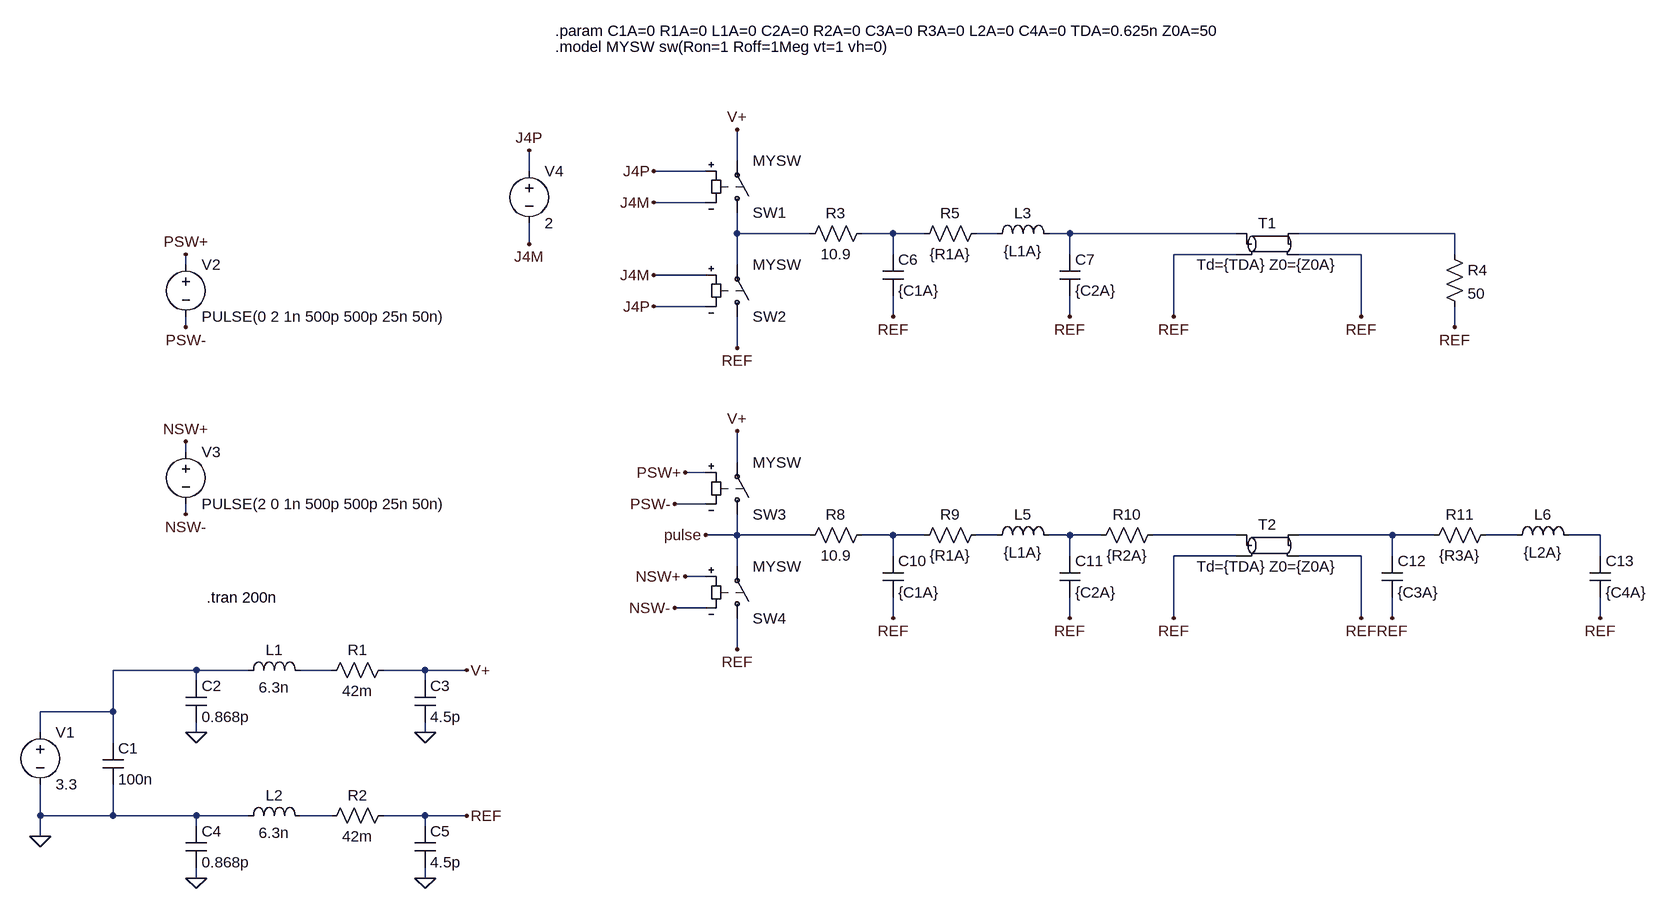
[diagram p0: schematic circuit_model.asc]
circuit_model.asc, the LTspice schematic file:
Version 4
SHEET 1 3648 1368
WIRE 1040 -752 1040 -800
WIRE 720 -736 720 -768
WIRE 992 -736 912 -736
WIRE 992 -688 912 -688
WIRE 1040 -640 1040 -672
WIRE 1152 -640 1040 -640
WIRE 1280 -640 1232 -640
WIRE 1328 -640 1280 -640
WIRE 1440 -640 1408 -640
WIRE 1552 -640 1520 -640
WIRE 1808 -640 1552 -640
WIRE 2144 -640 1904 -640
WIRE 720 -624 720 -656
WIRE 1280 -608 1280 -640
WIRE 1552 -608 1552 -640
WIRE 1808 -608 1712 -608
WIRE 2000 -608 1904 -608
WIRE 2144 -608 2144 -640
WIRE 192 -592 192 -608
WIRE 1040 -592 1040 -640
WIRE 992 -576 912 -576
WIRE 992 -528 912 -528
WIRE 1280 -512 1280 -544
WIRE 1552 -512 1552 -544
WIRE 1712 -512 1712 -608
WIRE 2000 -512 2000 -608
WIRE 192 -496 192 -512
WIRE 2144 -496 2144 -528
WIRE 1040 -464 1040 -512
WIRE 192 -304 192 -320
WIRE 1040 -288 1040 -336
WIRE 992 -272 960 -272
WIRE 992 -224 944 -224
WIRE 192 -208 192 -224
WIRE 1040 -176 1040 -208
WIRE 1040 -176 992 -176
WIRE 1152 -176 1040 -176
WIRE 1280 -176 1232 -176
WIRE 1328 -176 1280 -176
WIRE 1440 -176 1408 -176
WIRE 1552 -176 1520 -176
WIRE 1600 -176 1552 -176
WIRE 1808 -176 1680 -176
WIRE 2048 -176 1904 -176
WIRE 2112 -176 2048 -176
WIRE 2240 -176 2192 -176
WIRE 2368 -176 2320 -176
WIRE 1280 -144 1280 -176
WIRE 1552 -144 1552 -176
WIRE 1808 -144 1712 -144
WIRE 2000 -144 1904 -144
WIRE 2048 -144 2048 -176
WIRE 2368 -144 2368 -176
WIRE 1040 -128 1040 -176
WIRE 992 -112 960 -112
WIRE 992 -64 944 -64
WIRE 1280 -48 1280 -80
WIRE 1552 -48 1552 -80
WIRE 1712 -48 1712 -144
WIRE 2000 -48 2000 -144
WIRE 2048 -48 2048 -80
WIRE 2368 -48 2368 -80
WIRE 1040 0 1040 -48
WIRE 208 32 80 32
WIRE 288 32 208 32
WIRE 416 32 368 32
WIRE 560 32 496 32
WIRE 624 32 560 32
WIRE 208 48 208 32
WIRE 560 48 560 32
WIRE 80 96 80 32
WIRE 80 96 -32 96
WIRE -32 128 -32 96
WIRE 208 128 208 112
WIRE 560 128 560 112
WIRE 80 144 80 96
WIRE -32 256 -32 208
WIRE 80 256 80 208
WIRE 80 256 -32 256
WIRE 208 256 80 256
WIRE 288 256 208 256
WIRE 416 256 368 256
WIRE 560 256 496 256
WIRE 624 256 560 256
WIRE 208 272 208 256
WIRE 560 272 560 256
WIRE -32 288 -32 256
WIRE 208 352 208 336
WIRE 560 352 560 336
FLAG -32 288 0
FLAG 560 128 0
FLAG 208 128 0
FLAG 560 352 0
FLAG 208 352 0
FLAG 624 32 V+
FLAG 624 256 REF
FLAG 1040 -800 V+
FLAG 1040 -464 REF
FLAG 1280 -512 REF
FLAG 1552 -512 REF
FLAG 2000 -512 REF
FLAG 1712 -512 REF
FLAG 192 -496 PSW-
FLAG 192 -608 PSW+
FLAG 192 -208 NSW-
FLAG 192 -320 NSW+
FLAG 2144 -496 REF
FLAG 960 -272 PSW+
FLAG 944 -224 PSW-
FLAG 960 -112 NSW+
FLAG 944 -64 NSW-
FLAG 1040 -336 V+
FLAG 1040 0 REF
FLAG 1280 -48 REF
FLAG 1552 -48 REF
FLAG 2048 -48 REF
FLAG 2368 -48 REF
FLAG 2000 -48 REF
FLAG 1712 -48 REF
FLAG 992 -176 pulse
FLAG 912 -688 J4M
FLAG 912 -736 J4P
FLAG 720 -624 J4M
FLAG 720 -768 J4P
FLAG 912 -528 J4P
FLAG 912 -576 J4M
SYMBOL voltage -32 112 R0
WINDOW 123 0 0 Left 0
WINDOW 39 0 0 Left 0
SYMATTR InstName V1
SYMATTR Value 3.3
SYMBOL cap 64 144 R0
SYMATTR InstName C1
SYMATTR Value 100n
SYMBOL cap 192 48 R0
SYMATTR InstName C2
SYMATTR Value 0.868p
SYMBOL ind 272 48 R270
WINDOW 0 32 56 VTop 2
WINDOW 3 5 56 VBottom 2
SYMATTR InstName L1
SYMATTR Value 6.3n
SYMBOL res 512 16 R90
WINDOW 0 0 56 VBottom 2
WINDOW 3 32 56 VTop 2
SYMATTR InstName R1
SYMATTR Value 42m
SYMBOL cap 544 48 R0
SYMATTR InstName C3
SYMATTR Value 4.5p
SYMBOL cap 192 272 R0
SYMATTR InstName C4
SYMATTR Value 0.868p
SYMBOL ind 272 272 R270
WINDOW 0 32 56 VTop 2
WINDOW 3 5 56 VBottom 2
SYMATTR InstName L2
SYMATTR Value 6.3n
SYMBOL res 512 240 R90
WINDOW 0 0 56 VBottom 2
WINDOW 3 32 56 VTop 2
SYMATTR InstName R2
SYMATTR Value 42m
SYMBOL cap 544 272 R0
SYMATTR InstName C5
SYMATTR Value 4.5p
SYMBOL sw 1040 -656 M180
SYMATTR InstName SW1
SYMATTR Value MYSW
SYMBOL res 1248 -656 R90
WINDOW 0 0 56 VBottom 2
WINDOW 3 32 56 VTop 2
SYMATTR InstName R3
SYMATTR Value 10.9
SYMBOL sw 1040 -496 M180
SYMATTR InstName SW2
SYMATTR Value MYSW
SYMBOL cap 1264 -608 R0
SYMATTR InstName C6
SYMATTR Value {C1A}
SYMBOL res 1424 -656 R90
WINDOW 0 0 56 VBottom 2
WINDOW 3 32 56 VTop 2
SYMATTR InstName R5
SYMATTR Value {R1A}
SYMBOL ind 1424 -624 R270
WINDOW 0 32 56 VTop 2
WINDOW 3 5 56 VBottom 2
SYMATTR InstName L3
SYMATTR Value {L1A}
SYMBOL tline 1856 -624 R0
SYMATTR InstName T1
SYMATTR Value Td={TDA} Z0={Z0A}
SYMBOL cap 1536 -608 R0
SYMATTR InstName C7
SYMATTR Value {C2A}
SYMBOL voltage 192 -608 R0
WINDOW 123 0 0 Left 0
WINDOW 39 0 0 Left 0
SYMATTR InstName V2
SYMATTR Value PULSE(0 2 1n 500p 500p 25n 50n)
SYMBOL voltage 192 -320 R0
WINDOW 123 0 0 Left 0
WINDOW 39 0 0 Left 0
SYMATTR InstName V3
SYMATTR Value PULSE(2 0 1n 500p 500p 25n 50n)
SYMBOL res 2128 -624 R0
SYMATTR InstName R4
SYMATTR Value 50
SYMBOL sw 1040 -192 M180
SYMATTR InstName SW3
SYMATTR Value MYSW
SYMBOL res 1248 -192 R90
WINDOW 0 0 56 VBottom 2
WINDOW 3 32 56 VTop 2
SYMATTR InstName R8
SYMATTR Value 10.9
SYMBOL sw 1040 -32 M180
SYMATTR InstName SW4
SYMATTR Value MYSW
SYMBOL cap 1264 -144 R0
SYMATTR InstName C10
SYMATTR Value {C1A}
SYMBOL res 1424 -192 R90
WINDOW 0 0 56 VBottom 2
WINDOW 3 32 56 VTop 2
SYMATTR InstName R9
SYMATTR Value {R1A}
SYMBOL ind 1424 -160 R270
WINDOW 0 32 56 VTop 2
WINDOW 3 5 56 VBottom 2
SYMATTR InstName L5
SYMATTR Value {L1A}
SYMBOL res 1696 -192 R90
WINDOW 0 0 56 VBottom 2
WINDOW 3 32 56 VTop 2
SYMATTR InstName R10
SYMATTR Value {R2A}
SYMBOL tline 1856 -160 R0
SYMATTR InstName T2
SYMATTR Value Td={TDA} Z0={Z0A}
SYMBOL res 2208 -192 R90
WINDOW 0 0 56 VBottom 2
WINDOW 3 32 56 VTop 2
SYMATTR InstName R11
SYMATTR Value {R3A}
SYMBOL ind 2224 -160 R270
WINDOW 0 32 56 VTop 2
WINDOW 3 5 56 VBottom 2
SYMATTR InstName L6
SYMATTR Value {L2A}
SYMBOL cap 1536 -144 R0
SYMATTR InstName C11
SYMATTR Value {C2A}
SYMBOL cap 2032 -144 R0
SYMATTR InstName C12
SYMATTR Value {C3A}
SYMBOL cap 2352 -144 R0
SYMATTR InstName C13
SYMATTR Value {C4A}
SYMBOL voltage 720 -752 R0
WINDOW 123 0 0 Left 0
WINDOW 39 0 0 Left 0
SYMATTR InstName V4
SYMATTR Value 2
TEXT 760 -952 Left 2 !.param C1A=0 R1A=0 L1A=0 C2A=0 R2A=0 C3A=0 R3A=0 L2A=0 C4A=0 TDA=0.625n Z0A=50
TEXT 760 -928 Left 2 !.model MYSW sw(Ron=1 Roff=1Meg vt=1 vh=0)
TEXT 224 -80 Left 2 !.tran 200n

The netlist it stands for:
* circuit_model.asc
V1 N013 0 3.3
C1 N013 0 100n
C2 N013 0 0.868p
L1 N013 N014 6.3n
R1 V+ N014 42m
C3 V+ 0 4.5p
C4 0 0 0.868p
L2 0 N015 6.3n
R2 REF N015 42m
C5 REF 0 4.5p
SW1 N001 V+ J4P J4M MYSW
R3 N002 N001 10.9
SW2 REF N001 J4M J4P MYSW
C6 N002 REF {C1A}
R5 N003 N002 {R1A}
L3 N003 N004 {L1A}
T1 N004 REF N005 REF Td={TDA} Z0={Z0A}
C7 N004 REF {C2A}
V2 PSW+ PSW- PULSE(0 2 1n 500p 500p 25n 50n)
V3 NSW+ NSW- PULSE(2 0 1n 500p 500p 25n 50n)
R4 N005 REF 50
SW3 pulse V+ PSW+ PSW- MYSW
R8 N006 pulse 10.9
SW4 REF pulse NSW+ NSW- MYSW
C10 N006 REF {C1A}
R9 N007 N006 {R1A}
L5 N007 N008 {L1A}
R10 N009 N008 {R2A}
T2 N009 REF N010 REF Td={TDA} Z0={Z0A}
R11 N011 N010 {R3A}
L6 N011 N012 {L2A}
C11 N008 REF {C2A}
C12 N010 REF {C3A}
C13 N012 REF {C4A}
V4 J4P J4M 2
.param C1A=0 R1A=0 L1A=0 C2A=0 R2A=0 C3A=0 R3A=0 L2A=0 C4A=0 TDA=0.625n Z0A=50
.model MYSW sw(Ron=1 Roff=1Meg vt=1 vh=0)
.tran 200n
.backanno
.end